# Altium schematic sheet Sheet3.SchDoc
size A; SheetNumber: 3; SheetTotal: 3
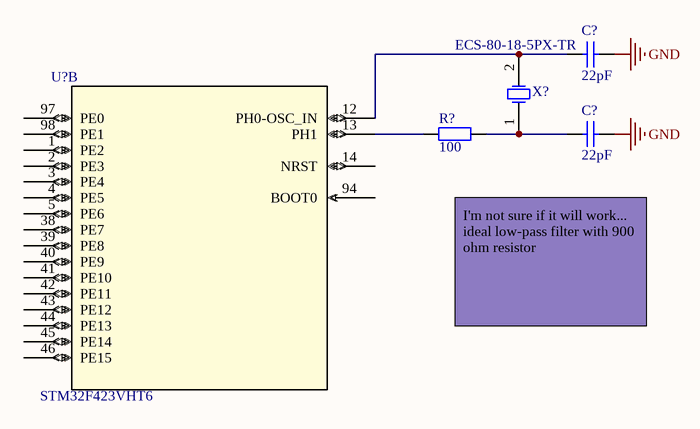
[diagram p0: Sheet3.SchDoc]

## Parts
(Parts that share a designator on the sheet are numbered #1, #2 ... from top to bottom, then left to right.)
C?#1  22pF  [FP_0805_CAP_085]
C?#2  22pF  [FP_0805_CAP_085]
R?  100  [FP_0805_RES]
U?  STM32F423VHT6  [LQFP100-14x14mm]  (part B of 3)
X?  ECS-80-18-5PX-TR  [ECS-80-18-5PX-TR_V]

## Nets
GND: C?#1.1 C?#2.1
NetC?#1_2: C?#1.2 U?.12(PH0-OSC_IN) X?.2(X2)
NetC?#2_2: C?#2.2 R?.1 X?.1(X1)
NetR?_2: R?.2 U?.13(PH1)

Not connected (* = marked no-connect by the designer): U? 1(PE2) 2(PE3) 3(PE4) 4(PE5) 5(PE6) 14(NRST) 38(PE7) 39(PE8) 40(PE9) 41(PE10) 42(PE11) 43(PE12) 44(PE13) 45(PE14) 46(PE15) 94(BOOT0) 97(PE0) 98(PE1)

## Notes on the sheet
- I'm not sure if it will work...  ideal low-pass filter with 900 ohm resistor

## Library data of the parts
C?#1 C?#2 = CAP: Capacitor; Value: 22pF
R? = RES: Resistor; Value: 100
U? = STM32F423VHT6: No Description Available; Mfr_Name: STMicroelectronics; RefDes: RefDes; Type: Type
X? = CMP-2000-06193-1: Low Profile Quartz Crystal, 8.0 MHz, 2-Pin SMD, RoHS, Tape and Reel; Brand: ECS; Tolerance: 30PPM; Case Height: 4.3mm; Frequency: 8MHz; Frequency Stability: 50PPM; Case Length: 13.2mm; Case Width: 4.8mm; Load Capacitance: 18pF; Termination Style: SMD/SMT; Product Category: Crystals; Packaging: Reel; Package Reference: ECS-80-18-5PX-TR; Mounting Technology: SurfaceMount; Dimensions: 4.8mmWx13.2mmLx4.3mmH; Package Description: 2-Pin Surface Mount Device, Body 11.4 x 4.8 mm, Height 4.3 mm; Datasheet URL: https://www.ecsxtal.com/store/pdf/csm-7x.pdf; Datasheet Version: 05/2016; Manufacturer: ECS; Factory Pack Quantity: 1000; Manufacturer URL: https://www.ecsxtal.com/; Type: SMDQuartzCrystals; Mounting Style: SMD/SMT; Package / Case: HC-49/US; Operating Temperature Range: -10Cto+70C; RoHS: Details; Series: CSM-7X